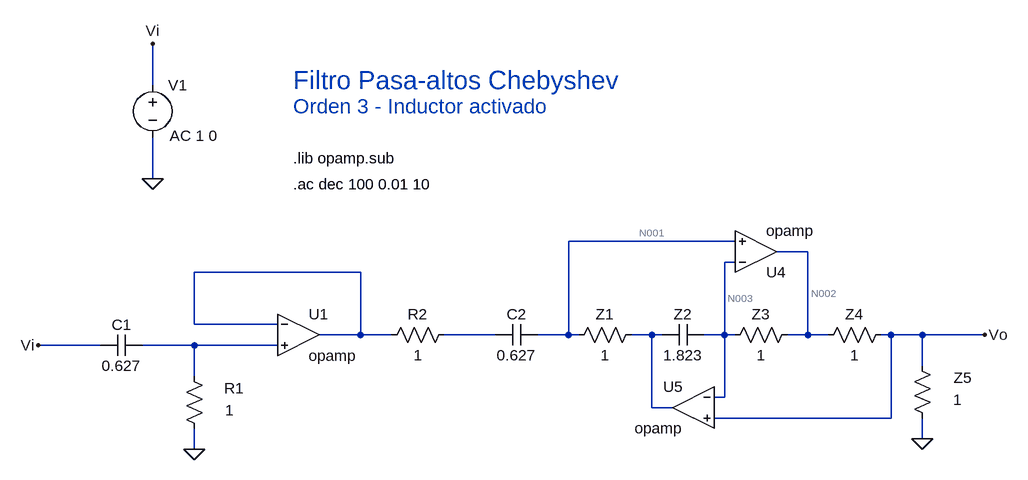
[diagram p0: schematic Circuito_1c.asc]
Circuito_1c.asc, the LTspice schematic file:
Version 4
SHEET 1 1392 680
WIRE -112 -416 -112 -480
WIRE -112 -272 -112 -336
WIRE 784 -176 528 -176
WIRE 896 -160 848 -160
WIRE 784 -144 768 -144
WIRE 208 -128 -48 -128
WIRE -48 -48 -48 -128
WIRE 80 -48 -48 -48
WIRE 208 -32 208 -128
WIRE 208 -32 144 -32
WIRE 256 -32 208 -32
WIRE 416 -32 336 -32
WIRE 528 -32 528 -176
WIRE 528 -32 480 -32
WIRE 544 -32 528 -32
WIRE 656 -32 624 -32
WIRE 672 -32 656 -32
WIRE 768 -32 768 -144
WIRE 768 -32 736 -32
WIRE 784 -32 768 -32
WIRE 896 -32 896 -160
WIRE 896 -32 864 -32
WIRE 928 -32 896 -32
WIRE 1024 -32 1008 -32
WIRE 1072 -32 1024 -32
WIRE 1168 -32 1072 -32
WIRE -192 -16 -288 -16
WIRE -48 -16 -128 -16
WIRE 80 -16 -48 -16
WIRE 1072 16 1072 -32
WIRE -48 32 -48 -16
WIRE 768 64 768 -32
WIRE 768 64 752 64
WIRE 656 80 656 -32
WIRE 688 80 656 80
WIRE 1024 96 1024 -32
WIRE 1024 96 752 96
WIRE 1072 128 1072 96
WIRE -48 144 -48 112
FLAG -288 -16 Vi
FLAG 1168 -32 Vo
FLAG -112 -272 0
FLAG -112 -480 Vi
FLAG -48 144 0
FLAG 1072 128 0
SYMBOL OpAmps\\opamp 112 -96 R0
SYMATTR InstName U1
SYMBOL res 352 -48 R90
WINDOW 0 0 56 VBottom 2
WINDOW 3 32 56 VTop 2
SYMATTR InstName R2
SYMATTR Value 1
SYMBOL cap 480 -48 R90
WINDOW 0 0 32 VBottom 2
WINDOW 3 32 32 VTop 2
SYMATTR InstName C2
SYMATTR Value 0.627
SYMBOL voltage -112 -432 R0
WINDOW 123 26 94 Left 2
WINDOW 39 0 0 Left 0
SYMATTR Value2 AC 1 0
SYMATTR InstName V1
SYMATTR Value ""
SYMBOL res -32 128 R180
WINDOW 0 -61 78 Left 2
WINDOW 3 -45 44 Left 2
SYMATTR InstName R1
SYMATTR Value 1
SYMBOL res 640 -48 R90
WINDOW 0 0 56 VBottom 2
WINDOW 3 32 56 VTop 2
SYMATTR InstName Z1
SYMATTR Value 1
SYMBOL cap 736 -48 R90
WINDOW 0 0 32 VBottom 2
WINDOW 3 32 32 VTop 2
SYMATTR InstName Z2
SYMATTR Value 1.823
SYMBOL res 880 -48 R90
WINDOW 0 0 56 VBottom 2
WINDOW 3 32 56 VTop 2
SYMATTR InstName Z3
SYMATTR Value 1
SYMBOL res 1024 -48 R90
WINDOW 0 0 56 VBottom 2
WINDOW 3 32 56 VTop 2
SYMATTR InstName Z4
SYMATTR Value 1
SYMBOL res 1088 112 R180
WINDOW 0 -61 78 Left 2
WINDOW 3 -45 44 Left 2
SYMATTR InstName Z5
SYMATTR Value 1
SYMBOL OpAmps\\opamp 816 -96 M180
SYMATTR InstName U4
SYMBOL OpAmps\\opamp 720 16 M0
SYMATTR InstName U5
SYMBOL cap -128 -32 R90
WINDOW 0 0 32 VBottom 2
WINDOW 3 32 32 VTop 2
SYMATTR InstName C1
SYMATTR Value 0.627
TEXT 104 -304 Left 2 !.lib opamp.sub
TEXT 104 -264 Left 2 !.ac dec 100 0.01 10
TEXT 104 -424 Left 4 ;Filtro Pasa-altos Chebyshev
TEXT 104 -384 Left 3 ;Orden 3 - Inductor activado

The netlist it stands for:
* Circuito_1c.asc
XU1 N004 N007 N004 opamp Aol=100K GBW=10Meg  ; pins invin noninvin out
R2 N005 N004 1
C2 N001 N005 0.627
V1 Vi 0 AC 1 0
R1 0 N007 1
R§Z1 N006 N001 1
C§Z2 N003 N006 1.823
R§Z3 N002 N003 1
R§Z4 Vo N002 1
R§Z5 0 Vo 1
XU4 N003 N001 N002 opamp Aol=100K GBW=10Meg  ; pins invin noninvin out
XU5 N003 Vo N006 opamp Aol=100K GBW=10Meg  ; pins invin noninvin out
C1 N007 Vi 0.627
.lib opamp.sub
.ac dec 100 0.01 10
* Filtro Pasa-altos Chebyshev
* Orden 3 - Inductor activado
.backanno
.end

* Results of the author's LTspice run, read from the files saved beside the schematic
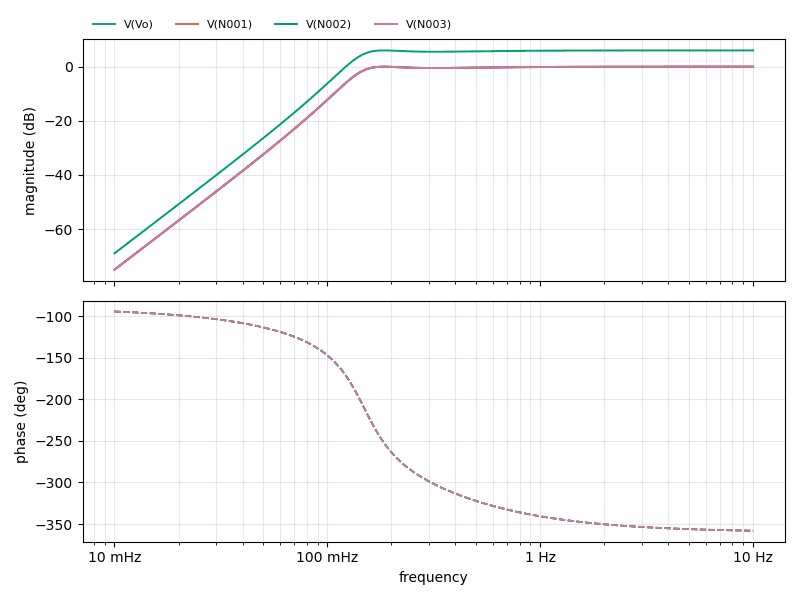
[diagram p1: AC Analysis of Circuito_1c.asc, plotted from the saved traces]
* AC Analysis, 1 run:
*   V(Vo): -74.98 dB at 10 mHz, -0.00 dB at 10 Hz, peak -0.00 dB at 10 Hz, 3 dB below the peak at 136.3 mHz
*   V(N001): -74.98 dB at 10 mHz, -0.00 dB at 10 Hz, peak -0.00 dB at 10 Hz, 3 dB below the peak at 136.3 mHz
*   V(N002): -68.96 dB at 10 mHz, 6.02 dB at 10 Hz, peak 6.02 dB at 10 Hz, 3 dB below the peak at 136.3 mHz
*   V(N003): -74.98 dB at 10 mHz, -0.00 dB at 10 Hz, peak -0.00 dB at 10 Hz, 3 dB below the peak at 136.3 mHz